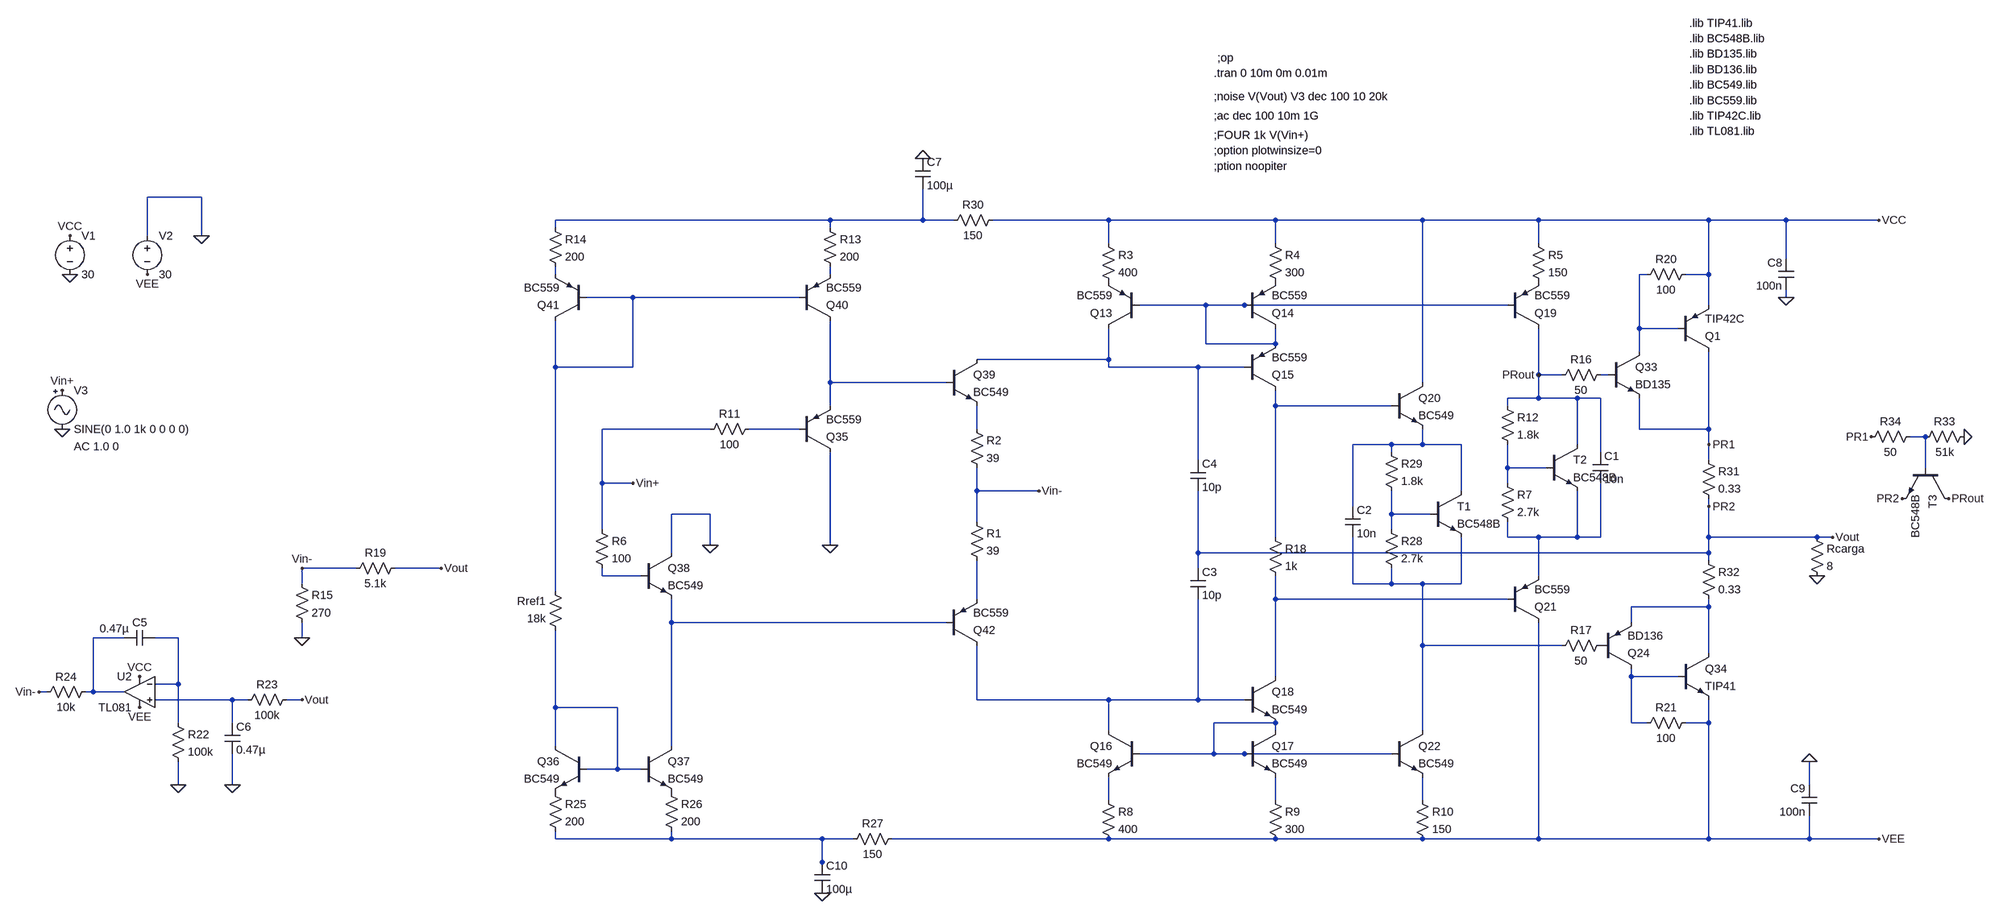
[diagram p0: schematic CircuitoCompletoPDE1V1_ProteccionesV2.asc]
CircuitoCompletoPDE1V1_ProteccionesV2.asc, the LTspice schematic file:
Version 4
SHEET 1 4272 1460
WIRE -912 -288 -1024 -288
WIRE 448 -240 -128 -240
WIRE 640 -240 640 -304
WIRE 640 -240 448 -240
WIRE 704 -240 640 -240
WIRE 1024 -240 784 -240
WIRE 1376 -240 1024 -240
WIRE 1680 -240 1376 -240
WIRE 1920 -240 1680 -240
WIRE 2272 -240 1920 -240
WIRE 2432 -240 2272 -240
WIRE 2624 -240 2432 -240
WIRE -128 -224 -128 -240
WIRE 448 -224 448 -240
WIRE -1024 -208 -1024 -288
WIRE -912 -208 -912 -288
WIRE 1024 -192 1024 -240
WIRE 1376 -192 1376 -240
WIRE 1920 -192 1920 -240
WIRE 2432 -160 2432 -240
WIRE -128 -128 -128 -144
WIRE 448 -128 448 -144
WIRE 2144 -128 2128 -128
WIRE 2272 -128 2272 -240
WIRE 2272 -128 2224 -128
WIRE 32 -80 -64 -80
WIRE 384 -80 32 -80
WIRE 2432 -80 2432 -96
WIRE 1232 -64 1088 -64
WIRE 1312 -64 1232 -64
WIRE 1856 -64 1312 -64
WIRE 2272 -64 2272 -128
WIRE 2128 -16 2128 -128
WIRE 2208 -16 2128 -16
WIRE 1232 16 1232 -64
WIRE 1376 16 1376 -16
WIRE 1376 16 1232 16
WIRE 2128 32 2128 -16
WIRE 1024 48 1024 -16
WIRE 1024 48 752 48
WIRE -128 64 -128 -32
WIRE 32 64 32 -80
WIRE 32 64 -128 64
WIRE 1024 64 1024 48
WIRE 1216 64 1024 64
WIRE 1312 64 1216 64
WIRE 1920 80 1920 -16
WIRE 1968 80 1920 80
WIRE 2064 80 2048 80
WIRE 448 96 448 -32
WIRE 688 96 448 96
WIRE 1680 96 1680 -240
WIRE 1920 128 1920 80
WIRE 1920 128 1856 128
WIRE 2000 128 1920 128
WIRE 2048 128 2000 128
WIRE 448 144 448 96
WIRE 1376 144 1376 112
WIRE 1616 144 1376 144
WIRE 1856 144 1856 128
WIRE 192 192 -32 192
WIRE 384 192 272 192
WIRE 752 192 752 144
WIRE 2128 192 2128 128
WIRE 2272 192 2272 32
WIRE 2272 192 2128 192
WIRE 2720 208 2688 208
WIRE 1616 224 1536 224
WIRE 1680 224 1680 192
WIRE 1680 224 1616 224
WIRE 1760 224 1680 224
WIRE 2000 224 2000 128
WIRE 2272 224 2272 192
WIRE 1616 240 1616 224
WIRE 2048 240 2048 128
WIRE 1216 256 1216 64
WIRE 2272 256 2272 224
WIRE 1856 272 1856 224
WIRE 1936 272 1856 272
WIRE 2720 272 2720 208
WIRE -32 304 -32 192
WIRE 32 304 -32 304
WIRE 1856 304 1856 272
WIRE 752 320 752 272
WIRE 880 320 752 320
WIRE 1760 320 1760 224
WIRE 1536 352 1536 224
WIRE 2272 352 2272 336
WIRE 192 368 112 368
WIRE 1616 368 1616 320
WIRE 1696 368 1616 368
WIRE 752 384 752 320
WIRE -32 400 -32 304
WIRE 1616 400 1616 368
WIRE 1376 416 1376 144
WIRE 1856 416 1856 384
WIRE 1920 416 1856 416
WIRE 2000 416 2000 320
WIRE 2000 416 1920 416
WIRE 2048 416 2048 304
WIRE 2048 416 2000 416
WIRE 2272 416 2272 352
WIRE 2496 416 2272 416
WIRE 2528 416 2496 416
WIRE 192 432 192 368
WIRE 448 432 448 240
WIRE 112 448 112 368
WIRE 1216 448 1216 320
WIRE 2272 448 2272 416
WIRE 2272 448 1216 448
WIRE 2272 464 2272 448
WIRE -592 480 -704 480
WIRE -416 480 -512 480
WIRE 1216 480 1216 448
WIRE -32 496 -32 480
WIRE 48 496 -32 496
WIRE 1920 496 1920 416
WIRE -704 512 -704 480
WIRE 1536 512 1536 416
WIRE 1616 512 1616 480
WIRE 1616 512 1536 512
WIRE 1680 512 1616 512
WIRE 1760 512 1760 416
WIRE 1760 512 1680 512
WIRE -128 528 -128 64
WIRE 752 544 752 464
WIRE 1376 544 1376 496
WIRE 1856 544 1376 544
WIRE 2272 560 2272 544
WIRE 2272 560 2112 560
WIRE 112 592 112 544
WIRE 688 592 112 592
WIRE 2112 592 2112 560
WIRE -1072 624 -1136 624
WIRE -960 624 -1008 624
WIRE -704 624 -704 592
WIRE 1680 640 1680 512
WIRE 1968 640 1680 640
WIRE 2272 656 2272 560
WIRE 1376 704 1376 544
WIRE 2112 704 2112 688
WIRE 2208 704 2112 704
WIRE -960 720 -960 624
WIRE -960 720 -1008 720
WIRE -1232 736 -1248 736
WIRE -1136 736 -1136 624
WIRE -1136 736 -1152 736
WIRE -1072 736 -1136 736
WIRE -848 752 -1008 752
WIRE -816 752 -848 752
WIRE -704 752 -736 752
WIRE 752 752 752 640
WIRE 1024 752 752 752
WIRE 1216 752 1216 544
WIRE 1216 752 1024 752
WIRE 1312 752 1216 752
WIRE -128 768 -128 608
WIRE 0 768 -128 768
WIRE -960 800 -960 720
WIRE -848 800 -848 752
WIRE 1376 800 1248 800
WIRE 2112 800 2112 704
WIRE 2144 800 2112 800
WIRE 2272 800 2272 752
WIRE 2272 800 2224 800
WIRE 1024 816 1024 752
WIRE 1376 816 1376 800
WIRE 1680 816 1680 640
WIRE -128 848 -128 768
WIRE 112 848 112 592
WIRE 1248 864 1248 800
WIRE 1248 864 1088 864
WIRE 1312 864 1248 864
WIRE 1616 864 1312 864
WIRE 0 896 0 768
WIRE 0 896 -64 896
WIRE 48 896 0 896
WIRE -960 928 -960 880
WIRE -848 928 -848 864
WIRE 2480 928 2480 880
WIRE 1024 960 1024 912
WIRE 1376 960 1376 912
WIRE 1680 960 1680 912
WIRE -128 1040 -128 1024
WIRE 112 1040 112 1024
WIRE 112 1040 -128 1040
WIRE 432 1040 112 1040
WIRE 496 1040 432 1040
WIRE 1024 1040 576 1040
WIRE 1376 1040 1024 1040
WIRE 1680 1040 1376 1040
WIRE 1920 1040 1920 592
WIRE 1920 1040 1680 1040
WIRE 2272 1040 2272 800
WIRE 2272 1040 1920 1040
WIRE 2480 1040 2480 992
WIRE 2480 1040 2272 1040
WIRE 2624 1040 2480 1040
WIRE 432 1088 432 1040
WIRE 432 1104 432 1088
FLAG -1184 -208 VCC
FLAG -1184 -128 0
FLAG -912 -208 0
FLAG -1024 -128 VEE
FLAG -1200 192 0
FLAG -1200 112 Vin+
FLAG 2528 416 Vout
FLAG -704 624 0
FLAG -704 480 Vin-
FLAG -416 480 Vout
FLAG 2496 496 0
FLAG -960 928 0
FLAG -848 928 0
FLAG -704 752 Vout
FLAG -1248 736 Vin-
FLAG -1040 768 VEE
FLAG -1040 704 VCC
FLAG 448 432 0
FLAG 192 432 0
FLAG 32 304 Vin+
FLAG 880 320 Vin-
FLAG 2624 1040 VEE
FLAG 2480 880 0
FLAG 2624 -240 VCC
FLAG 2432 -80 0
FLAG 432 1152 0
FLAG 640 -368 0
FLAG 2608 208 PR1
FLAG 2272 224 PR1
FLAG 2272 352 PR2
FLAG 2672 336 PR2
FLAG 2768 336 PRout
FLAG 1920 80 PRout
FLAG 2800 208 0
DATAFLAG 2368 416 ""
SYMBOL voltage -1184 -224 R0
WINDOW 123 0 0 Left 2
WINDOW 39 0 0 Left 2
SYMATTR InstName V1
SYMATTR Value 30
SYMBOL voltage -1024 -224 R0
SYMATTR InstName V2
SYMATTR Value 30
SYMBOL Misc\\signal -1200 96 R0
WINDOW 123 24 132 Left 2
WINDOW 39 0 0 Left 2
SYMATTR Value2 AC 1.0 0
SYMATTR InstName V3
SYMATTR Value SINE(0 1.0 1k 0 0 0 0)
SYMBOL npn 1088 816 M0
SYMATTR InstName Q16
SYMATTR Value BC549
SYMBOL res 1008 944 R0
SYMATTR InstName R8
SYMATTR Value 400
SYMBOL npn 1312 816 R0
SYMATTR InstName Q17
SYMATTR Value BC549
SYMBOL npn 1616 816 R0
SYMATTR InstName Q22
SYMATTR Value BC549
SYMBOL res 1360 944 R0
SYMATTR InstName R9
SYMATTR Value 300
SYMBOL res 1664 944 R0
SYMATTR InstName R10
SYMATTR Value 150
SYMBOL npn 1312 704 R0
SYMATTR InstName Q18
SYMATTR Value BC549
SYMBOL res 1360 400 R0
SYMATTR InstName R18
SYMATTR Value 1k
SYMBOL pnp 1312 112 M180
SYMATTR InstName Q15
SYMATTR Value BC559
SYMBOL pnp 1312 -16 M180
SYMATTR InstName Q14
SYMATTR Value BC559
SYMBOL res 1360 -208 R0
SYMATTR InstName R4
SYMATTR Value 300
SYMBOL pnp 1088 -16 R180
SYMATTR InstName Q13
SYMATTR Value BC559
SYMBOL res 1008 -208 R0
SYMATTR InstName R3
SYMATTR Value 400
SYMBOL pnp 1856 -16 M180
SYMATTR InstName Q19
SYMATTR Value BC559
SYMBOL res 1904 -208 R0
SYMATTR InstName R5
SYMATTR Value 150
SYMBOL npn 1616 96 R0
SYMATTR InstName Q20
SYMATTR Value BC549
SYMBOL pnp 1856 592 M180
SYMATTR InstName Q21
SYMATTR Value BC559
SYMBOL res 2064 624 R90
WINDOW 0 0 56 VBottom 2
WINDOW 3 32 56 VTop 2
SYMATTR InstName R17
SYMATTR Value 50
SYMBOL res 2064 64 R90
WINDOW 0 0 56 VBottom 2
WINDOW 3 32 56 VTop 2
SYMATTR InstName R16
SYMATTR Value 50
SYMBOL pnp 2048 688 M180
SYMATTR InstName Q24
SYMATTR Value BD136
SYMBOL cap 1200 480 R0
SYMATTR InstName C3
SYMATTR Value 10p
SYMBOL cap 1200 256 R0
SYMATTR InstName C4
SYMATTR Value 10p
SYMBOL res -720 496 R0
SYMATTR InstName R15
SYMATTR Value 270
SYMBOL res -496 464 R90
WINDOW 0 0 56 VBottom 2
WINDOW 3 32 56 VTop 2
SYMATTR InstName R19
SYMATTR Value 5.1k
SYMBOL res 2480 400 R0
SYMATTR InstName Rcarga
SYMATTR Value 8
SYMBOL npn 2064 32 R0
SYMATTR InstName Q33
SYMATTR Value BD135
SYMBOL res 2240 -144 R90
WINDOW 0 0 56 VBottom 2
WINDOW 3 32 56 VTop 2
SYMATTR InstName R20
SYMATTR Value 100
SYMBOL npn 2208 656 R0
SYMATTR InstName Q34
SYMATTR Value TIP41
SYMBOL res 2240 784 R90
WINDOW 0 0 56 VBottom 2
WINDOW 3 32 56 VTop 2
SYMATTR InstName R21
SYMATTR Value 100
SYMBOL cap -1008 608 R90
WINDOW 0 0 32 VBottom 2
WINDOW 3 -19 84 VTop 2
SYMATTR InstName C5
SYMATTR Value 0.47µ
SYMBOL res -976 784 R0
SYMATTR InstName R22
SYMATTR Value 100k
SYMBOL res -720 736 R90
WINDOW 0 0 56 VBottom 2
WINDOW 3 32 56 VTop 2
SYMATTR InstName R23
SYMATTR Value 100k
SYMBOL cap -864 800 R0
SYMATTR InstName C6
SYMATTR Value 0.47µ
SYMBOL res -1136 720 R90
WINDOW 0 0 56 VBottom 2
WINDOW 3 32 56 VTop 2
SYMATTR InstName R24
SYMATTR Value 10k
SYMBOL pnp 384 240 M180
SYMATTR InstName Q35
SYMATTR Value BC559
SYMBOL npn -64 848 M0
SYMATTR InstName Q36
SYMATTR Value BC549
SYMBOL npn 48 848 R0
SYMATTR InstName Q37
SYMATTR Value BC549
SYMBOL npn 48 448 R0
SYMATTR InstName Q38
SYMATTR Value BC549
SYMBOL npn 688 48 R0
SYMATTR InstName Q39
SYMATTR Value BC549
SYMBOL pnp 384 -32 M180
SYMATTR InstName Q40
SYMATTR Value BC559
SYMBOL pnp -64 -32 R180
SYMATTR InstName Q41
SYMATTR Value BC559
SYMBOL pnp 688 640 M180
SYMATTR InstName Q42
SYMATTR Value BC559
SYMBOL res -112 624 R180
WINDOW 0 36 76 Left 2
WINDOW 3 36 40 Left 2
SYMATTR InstName Rref1
SYMATTR Value 18k
SYMBOL res 1840 288 R0
SYMATTR InstName R7
SYMATTR Value 2.7k
SYMBOL npn 1936 224 R0
SYMATTR InstName T2
SYMATTR Value BC548B
SYMBOL res 1840 128 R0
SYMATTR InstName R12
SYMATTR Value 1.8k
SYMBOL res 736 368 R0
SYMATTR InstName R1
SYMATTR Value 39
SYMBOL res 736 176 R0
SYMATTR InstName R2
SYMATTR Value 39
SYMBOL res -48 384 R0
SYMATTR InstName R6
SYMATTR Value 100
SYMBOL res 176 208 R270
WINDOW 0 32 56 VTop 2
WINDOW 3 0 56 VBottom 2
SYMATTR InstName R11
SYMATTR Value 100
SYMBOL res 432 -240 R0
SYMATTR InstName R13
SYMATTR Value 200
SYMBOL res -144 -240 R0
SYMATTR InstName R14
SYMATTR Value 200
SYMBOL res -144 928 R0
SYMATTR InstName R25
SYMATTR Value 200
SYMBOL res 96 928 R0
SYMATTR InstName R26
SYMATTR Value 200
SYMBOL pnp 2208 32 M180
SYMATTR InstName Q1
SYMATTR Value TIP42C
SYMBOL res 1600 384 R0
SYMATTR InstName R28
SYMATTR Value 2.7k
SYMBOL npn 1696 320 R0
SYMATTR InstName T1
SYMATTR Value BC548B
SYMBOL res 1600 224 R0
SYMATTR InstName R29
SYMATTR Value 1.8k
SYMBOL Opamps\\opamp2 -1040 672 M0
SYMATTR InstName U2
SYMATTR Value TL081
SYMBOL cap 2032 240 R0
SYMATTR InstName C1
SYMATTR Value 10n
SYMBOL cap 1520 352 R0
SYMATTR InstName C2
SYMATTR Value 10n
SYMBOL cap 2496 928 M0
SYMATTR InstName C9
SYMATTR Value 100n
SYMBOL cap 2448 -160 M0
SYMATTR InstName C8
SYMATTR Value 100n
SYMBOL res 592 1024 R90
WINDOW 0 0 56 VBottom 2
WINDOW 3 32 56 VTop 2
SYMATTR InstName R27
SYMATTR Value 150
SYMBOL res 800 -256 R90
WINDOW 0 0 56 VBottom 2
WINDOW 3 32 56 VTop 2
SYMATTR InstName R30
SYMATTR Value 150
SYMBOL cap 624 -368 R0
SYMATTR InstName C7
SYMATTR Value 100µ
SYMBOL cap 416 1088 R0
SYMATTR InstName C10
SYMATTR Value 100µ
SYMBOL res 2256 240 R0
SYMATTR InstName R31
SYMATTR Value 0.33
SYMBOL res 2256 448 R0
SYMATTR InstName R32
SYMATTR Value 0.33
SYMBOL npn 2768 272 R90
SYMATTR InstName T3
SYMATTR Value BC548B
SYMBOL res 2704 192 R90
WINDOW 0 0 56 VBottom 2
WINDOW 3 32 56 VTop 2
SYMATTR InstName R34
SYMATTR Value 50
SYMBOL res 2816 192 R90
WINDOW 0 0 56 VBottom 2
WINDOW 3 32 56 VTop 2
SYMATTR InstName R33
SYMATTR Value 51k
TEXT 1248 -544 Left 2 !.tran 0 10m 0m 0.01m
TEXT 1248 -456 Left 2 !;ac dec 100 10m 1G
TEXT 2232 -648 Left 2 !.lib TIP41.lib
TEXT 2232 -584 Left 2 !.lib BD135.lib
TEXT 2232 -552 Left 2 !.lib BD136.lib
TEXT 2232 -616 Left 2 !.lib BC548B.lib
TEXT 1248 -496 Left 2 !;noise V(Vout) V3 dec 100 10 20k
TEXT 2232 -520 Left 2 !.lib BC549.lib
TEXT 2232 -488 Left 2 !.lib BC559.lib
TEXT 1256 -576 Left 2 !;op
TEXT 2232 -456 Left 2 !.lib TIP42C.lib
TEXT 1248 -416 Left 2 !;FOUR 1k V(Vin+)
TEXT 1248 -384 Left 2 !;option plotwinsize=0
TEXT 1248 -352 Left 2 !;ption noopiter
TEXT 2232 -424 Left 2 !.lib TL081.lib

The netlist it stands for:
* CircuitoCompletoPDE1V1_ProteccionesV2.asc
V1 VCC 0 30
V2 0 VEE 30
V3 Vin+ 0 SINE(0 1.0 1k 0 0 0 0) AC 1.0 0
Q16 N028 N030 N031 0 BC549
R8 N031 VEE 400
Q17 N030 N030 N032 0 BC549
Q22 N019 N030 N033 0 BC549
R9 N032 VEE 300
R10 N033 VEE 150
Q18 N021 N028 N030 0 BC549
R18 N010 N021 1k
Q15 N010 N007 N006 0 BC559
Q14 N006 N006 P001 0 BC559
R4 VCC P001 300
Q13 N007 N006 P002 0 BC559
R3 VCC P002 400
Q19 PRout N006 P003 0 BC559
R5 VCC P003 150
Q20 VCC N010 N014 0 BC549
Q21 VEE N021 N017 0 BC559
R17 P004 N019 50
R16 N008 PRout 50
Q24 N026 P004 N022 0 BD136
C3 PR2 N028 10p
C4 N007 PR2 10p
R15 Vin- 0 270
R19 PR2 Vin- 5.1k
Rcarga PR2 0 8
Q33 N004 N008 PR1 0 BD135
R20 VCC N004 100
Q34 N022 N026 VEE 0 TIP41
R21 VEE N026 100
C5 N025 N024 0.47µ
R22 N025 0 100k
R23 PR2 N027 100k
C6 N027 0 0.47µ
R24 N024 Vin- 10k
Q35 0 N011 N009 0 BC559
Q36 N029 N029 P005 0 BC549
Q37 N023 N029 P006 0 BC549
Q38 0 N018 N023 0 BC549
Q39 N007 N009 N012 0 BC549
Q40 N009 N005 N003 0 BC559
Q41 N005 N005 N002 0 BC559
Q42 N028 N023 N020 0 BC559
Rref1 N029 N005 18k
R7 N015 N017 2.7k
Q§T2 PRout N015 N017 0 BC548B
R12 PRout N015 1.8k
R1 Vin- N020 39
R2 N012 Vin- 39
R6 Vin+ N018 100
R11 Vin+ N011 100
R13 N001 N003 200
R14 N001 N002 200
R25 P005 N034 200
R26 P006 N034 200
Q1 PR1 N004 VCC 0 TIP42C
R28 N016 N019 2.7k
Q§T1 N014 N016 N019 0 BC548B
R29 N014 N016 1.8k
XU2 N027 N025 VCC VEE N024 TL081  ; pins In+ In- V+ V- OUT
C1 PRout N017 10n
C2 N014 N019 10n
C9 0 VEE 100n
C8 VCC 0 100n
R27 VEE N034 150
R30 VCC N001 150
C7 0 N001 100µ
C10 N034 0 100µ
R31 PR1 PR2 0.33
R32 PR2 N022 0.33
Q§T3 PRout N013 PR2 0 BC548B
R34 N013 PR1 50
R33 0 N013 51k
.model NPN NPN
.model PNP PNP
.lib standard.bjt
.tran 0 10m 0m 0.01m
;ac dec 100 10m 1G
.lib TIP41.lib
.lib BD135.lib
.lib BD136.lib
.lib BC548B.lib
;noise V(Vout) V3 dec 100 10 20k
.lib BC549.lib
.lib BC559.lib
;op
.lib TIP42C.lib
;FOUR 1k V(Vin+)
;option plotwinsize=0
;ption noopiter
.lib TL081.lib
.backanno
.end